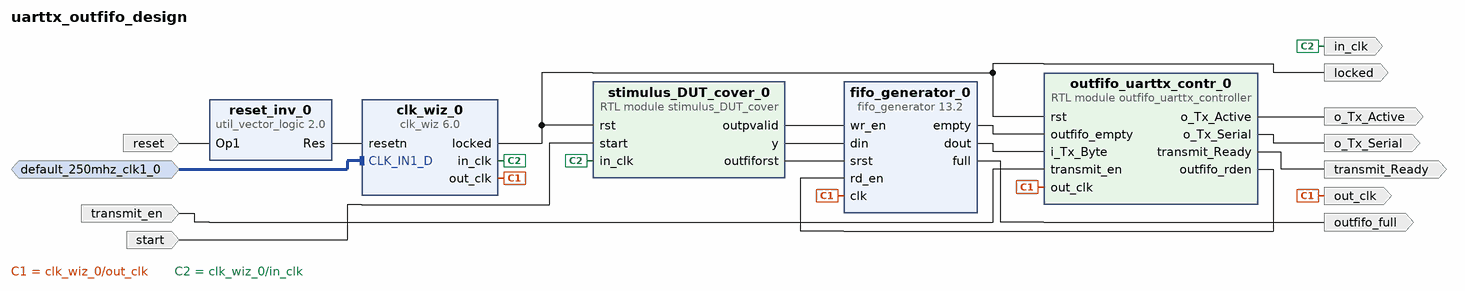
[diagram p0: block diagram of the top level]
# Vivado block design uarttx_outfifo_design, xcvu9p-flga2104-2L-e, Vivado 2019.1
create_bd_design uarttx_outfifo_design

create_bd_intf_port -mode Slave -vlnv xilinx.com:interface:diff_clock_rtl:1.0 default_250mhz_clk1_0
set_property -dict {CONFIG.FREQ_HZ 250000000} [get_bd_intf_ports default_250mhz_clk1_0]
create_bd_port -dir O o_Tx_Active
create_bd_port -dir O -type data o_Tx_Serial
create_bd_port -dir O transmit_Ready
create_bd_port -dir I transmit_en
create_bd_port -dir I start
create_bd_port -dir O outfifo_full
create_bd_port -dir O locked
create_bd_port -dir O -type clk in_clk
create_bd_port -dir O -type clk out_clk
create_bd_port -dir I -type rst reset
set_property -dict {CONFIG.POLARITY ACTIVE_HIGH} [get_bd_ports reset]

create_bd_cell -type module -reference stimulus_DUT_cover stimulus_DUT_cover_0
create_bd_cell -type ip -vlnv xilinx.com:ip:clk_wiz:6.0 clk_wiz_0
set_property -dict [list \
  CONFIG.CLKIN1_JITTER_PS 40.0 \
  CONFIG.CLKOUT1_JITTER 184.746 \
  CONFIG.CLKOUT1_PHASE_ERROR 154.678 \
  CONFIG.CLKOUT1_REQUESTED_OUT_FREQ 20.000 \
  CONFIG.CLKOUT2_JITTER 213.887 \
  CONFIG.CLKOUT2_PHASE_ERROR 154.678 \
  CONFIG.CLKOUT2_REQUESTED_OUT_FREQ 10.000 \
  CONFIG.CLKOUT2_USED true \
  CONFIG.CLK_IN1_BOARD_INTERFACE default_250mhz_clk1 \
  CONFIG.CLK_OUT1_PORT in_clk \
  CONFIG.CLK_OUT2_PORT out_clk \
  CONFIG.MMCM_CLKFBOUT_MULT_F 24.000 \
  CONFIG.MMCM_CLKIN1_PERIOD 4.000 \
  CONFIG.MMCM_CLKIN2_PERIOD 10.0 \
  CONFIG.MMCM_CLKOUT0_DIVIDE_F 60.000 \
  CONFIG.MMCM_CLKOUT1_DIVIDE 120 \
  CONFIG.MMCM_DIVCLK_DIVIDE 5 \
  CONFIG.NUM_OUT_CLKS 2 \
  CONFIG.PRIM_SOURCE Differential_clock_capable_pin \
  CONFIG.RESET_BOARD_INTERFACE reset \
  CONFIG.RESET_PORT resetn \
  CONFIG.RESET_TYPE ACTIVE_LOW \
  CONFIG.USE_BOARD_FLOW true \
  CONFIG.USE_RESET true \
] [get_bd_cells clk_wiz_0]
create_bd_cell -type ip -vlnv xilinx.com:ip:fifo_generator:13.2 fifo_generator_0
set_property -dict [list \
  CONFIG.Input_Data_Width 32 \
  CONFIG.Input_Depth 512 \
  CONFIG.Output_Data_Width 8 \
  CONFIG.asymmetric_port_width true \
] [get_bd_cells fifo_generator_0]
create_bd_cell -type ip -vlnv xilinx.com:ip:util_vector_logic:2.0 reset_inv_0
set_property -dict {CONFIG.C_OPERATION not CONFIG.C_SIZE 1} [get_bd_cells reset_inv_0]
create_bd_cell -type module -reference outfifo_uarttx_controller outfifo_uarttx_contr_0

# ---- connections ----

connect_bd_intf_net -intf_net default_250mhz_clk1_0_1 [get_bd_intf_ports default_250mhz_clk1_0] [get_bd_intf_pins clk_wiz_0/CLK_IN1_D]
connect_bd_net [get_bd_pins fifo_generator_0/empty] [get_bd_pins outfifo_uarttx_contr_0/outfifo_empty]
connect_bd_net [get_bd_pins fifo_generator_0/dout] [get_bd_pins outfifo_uarttx_contr_0/i_Tx_Byte]
connect_bd_net [get_bd_pins outfifo_uarttx_contr_0/outfifo_rden] [get_bd_pins fifo_generator_0/rd_en]
connect_bd_net [get_bd_pins clk_wiz_0/out_clk] [get_bd_ports out_clk] [get_bd_pins fifo_generator_0/clk] [get_bd_pins outfifo_uarttx_contr_0/out_clk]
connect_bd_net [get_bd_pins outfifo_uarttx_contr_0/o_Tx_Active] [get_bd_ports o_Tx_Active]
connect_bd_net [get_bd_pins outfifo_uarttx_contr_0/o_Tx_Serial] [get_bd_ports o_Tx_Serial]
connect_bd_net [get_bd_pins outfifo_uarttx_contr_0/transmit_Ready] [get_bd_ports transmit_Ready]
connect_bd_net [get_bd_ports transmit_en] [get_bd_pins outfifo_uarttx_contr_0/transmit_en]
connect_bd_net [get_bd_pins stimulus_DUT_cover_0/outpvalid] [get_bd_pins fifo_generator_0/wr_en]
connect_bd_net [get_bd_pins stimulus_DUT_cover_0/y] [get_bd_pins fifo_generator_0/din]
connect_bd_net [get_bd_ports start] [get_bd_pins stimulus_DUT_cover_0/start]
connect_bd_net [get_bd_pins clk_wiz_0/in_clk] [get_bd_ports in_clk] [get_bd_pins stimulus_DUT_cover_0/in_clk]
connect_bd_net [get_bd_pins fifo_generator_0/full] [get_bd_ports outfifo_full]
connect_bd_net [get_bd_pins stimulus_DUT_cover_0/outfiforst] [get_bd_pins fifo_generator_0/srst]
connect_bd_net [get_bd_pins clk_wiz_0/locked] [get_bd_ports locked] [get_bd_pins stimulus_DUT_cover_0/rst] [get_bd_pins outfifo_uarttx_contr_0/rst]
connect_bd_net [get_bd_pins reset_inv_0/Res] [get_bd_pins clk_wiz_0/resetn]
connect_bd_net [get_bd_ports reset] [get_bd_pins reset_inv_0/Op1]

validate_bd_design
save_bd_design
